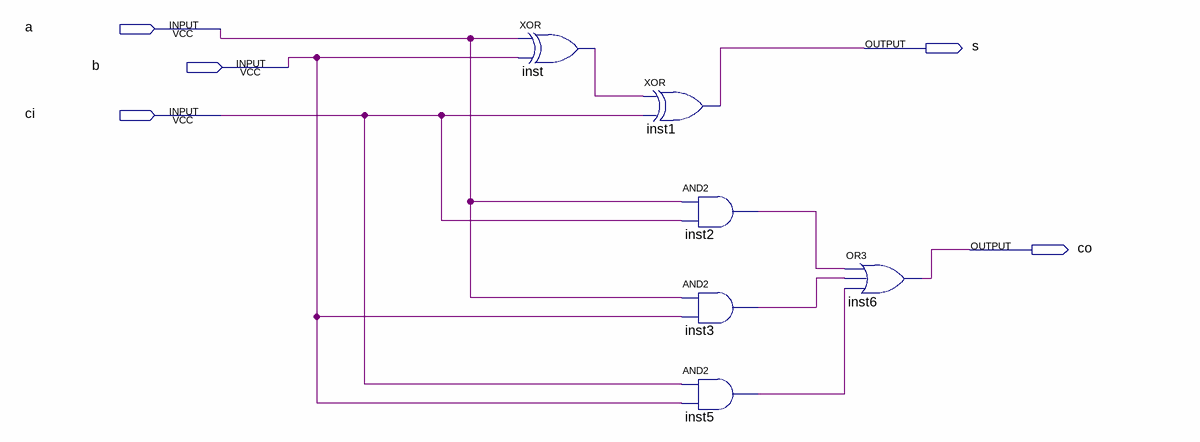
[diagram p0: schematic sheet]
// Quartus schematic fadder.bdf as structural Verilog: 6 symbols, 5 pins
module fadder (
  input  a,
  input  b,
  input  ci,
  output s,
  output co
);

  wire inst2_out, inst3_out, inst5_out, inst_out;

  xor inst (inst_out, a, b);
  xor inst1 (s, inst_out, ci);
  and inst2 (inst2_out, a, ci);
  and inst3 (inst3_out, a, b);
  and inst5 (inst5_out, ci, b);
  or inst6 (co, inst2_out, inst3_out, inst5_out);
endmodule
